# Altium schematic sheet SCH_ESPDMX V2.schdoc
size 487 x 214 mm
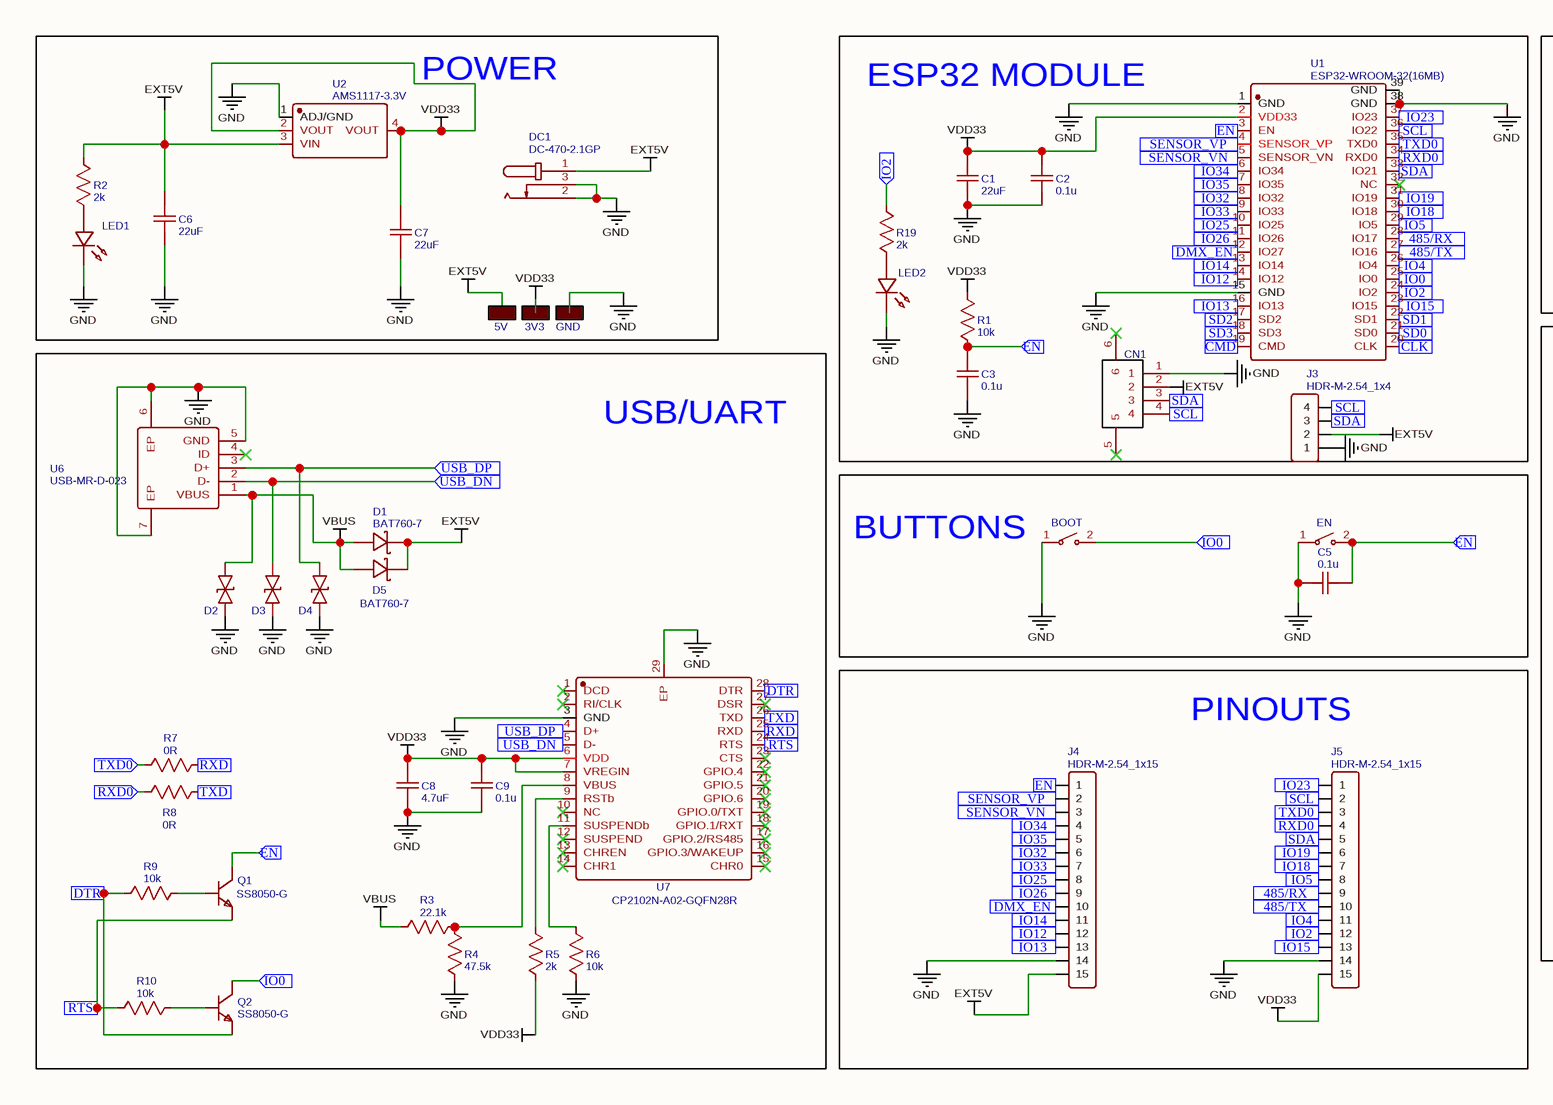
[diagram p0: SCH_ESPDMX V2.schdoc, left]
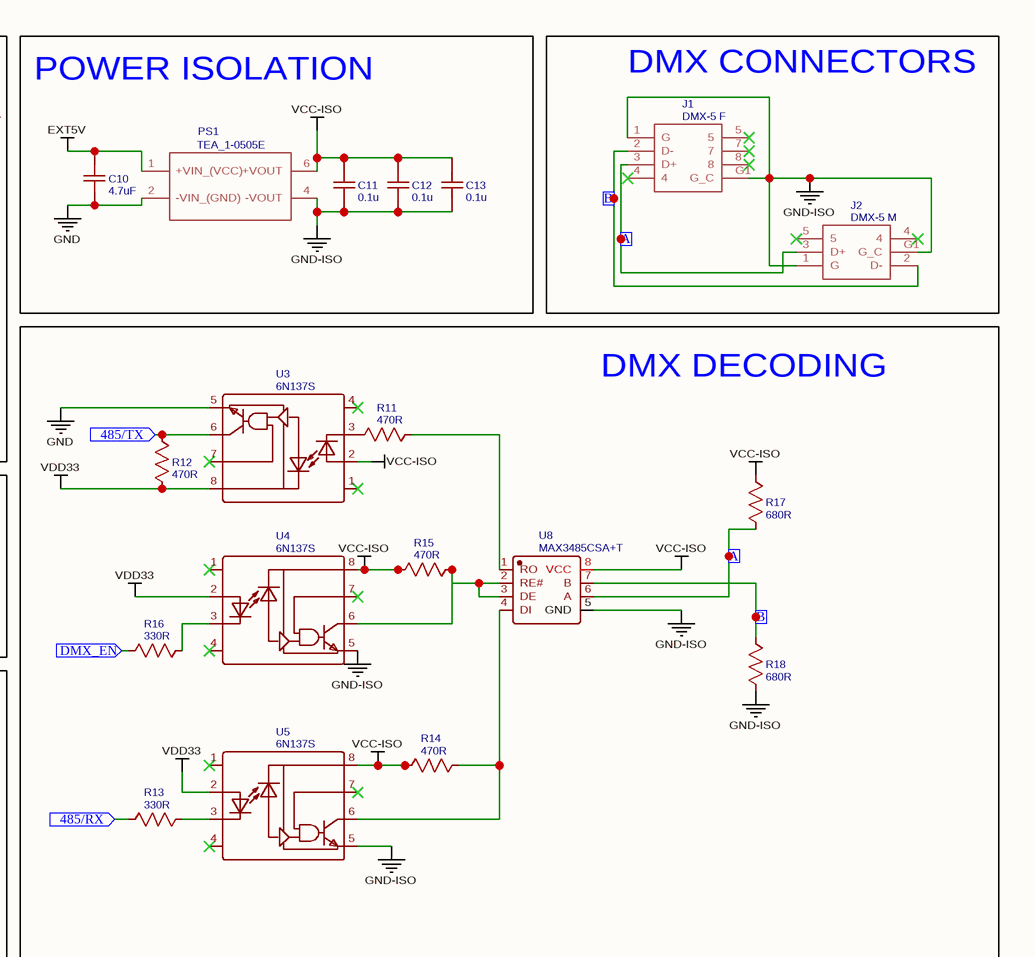
[diagram p1: SCH_ESPDMX V2.schdoc, right]

## Parts
3V3  SOLDERINGPADSONE  [SOLDERINGPAD_1]  (value not drawn)
5V  SOLDERINGPADSONE  [SOLDERINGPAD_1]  (value not drawn)
BOOT  TS-1088R-02026  [SW-SMD_L3.9-W3.0-P4.45]  (value not drawn)
C1  22uF  [C0805]
C2  0.1u  [C0805]
C3  0.1u  [C0805]
C5  0.1u  [C0805]
C6  22uF  [C0805]
C7  22uF  [C0805]
C8  4.7uF  [C0805]
C9  0.1u  [C0805]
C10  4.7uF  [C0805]
C11  0.1u  [C0805]
C12  0.1u  [C0805]
C13  0.1u  [C0805]
CN1  BM04B-GHS-TBT(LF)(SN)  [CONN-SMD_4P-P1.25_BM04B-GHS-TBT-LF-SN]  (value not drawn)
D1  BAT760-7  [SOD-323_L1.8-W1.3-LS2.5-RD]
D2  LESD5D5.0CT1G  [SOD-523_L1.2-W0.8-LS1.6-BI]  (value not drawn)
D3  LESD5D5.0CT1G  [SOD-523_L1.2-W0.8-LS1.6-BI]  (value not drawn)
D4  LESD5D5.0CT1G  [SOD-523_L1.2-W0.8-LS1.6-BI]  (value not drawn)
D5  BAT760-7  [SOD-323_L1.8-W1.3-LS2.5-RD]
DC1  DC-470-2.1GP  [DC-IN-TH_DC-470-2.1GP]
EN  TS-1088R-02026  [SW-SMD_L3.9-W3.0-P4.45]  (value not drawn)
GND  SOLDERINGPADSONE  [SOLDERINGPAD_1]  (value not drawn)
J1  DMX-5 F  [AC5FAHAUB]
J2  DMX-5 M  [AC5MAHAUB]
J3  HDR-M-2.54_1x4  [HDR-M-2.54_1X4]
J4  HDR-M-2.54_1x15  [HDR-M-2.54_1X15]
J5  HDR-M-2.54_1x15  [HDR-M-2.54_1X15]
LED1  LED-0805_R  [LED0805_RED]  (value not drawn)
LED2  LED-0805_B  [LED0805_BLUE]  (value not drawn)
PS1  TEA_1-0505E  [TEA10505E]
Q1  SS8050-G  [SOT-23-3_L2.9-W1.6-P1.90-LS2.8-BR]
Q2  SS8050-G  [SOT-23-3_L2.9-W1.6-P1.90-LS2.8-BR]
R1  10k  [R0805]
R2  2k  [R0805]
R3  22.1k  [R0805]
R4  47.5k  [R0805]
R5  2k  [R0805]
R6  10k  [R0805]
R7  0R  [R0805]
R8  0R  [R0805]
R9  10k  [R0805]
R10  10k  [R0805]
R11  470R  [R0805]
R12  470R  [R0805]
R13  330R  [R0805]
R14  470R  [R0805]
R15  470R  [R0805]
R16  330R  [R0805]
R17  680R  [R0805]
R18  680R  [R0805]
R19  2k  [R0805]
U1  ESP32-WROOM-32(16MB)  [WIFIM-SMD_39P-L25.5-W18.0-P1.27]
U2  AMS1117-3.3V  [SOT-223-4_L6.5-W3.5-P2.30-LS7.0-BR]
U3  6N137S  [SOP-8_L9.8-W6.6-P2.54-LS10.3-BL]
U4  6N137S  [SOP-8_L9.8-W6.6-P2.54-LS10.3-BL]
U5  6N137S  [SOP-8_L9.8-W6.6-P2.54-LS10.3-BL]
U6  USB-MR-D-023  [MICRO-USB-SMD_USB-MR-D-023]
U7  CP2102N-A02-GQFN28R  [QFN-28_L5.0-W5.0-P0.50-TL-EP3.3]
U8  MAX3485CSA+T  [SO-8_L4.9-W3.9-P1.27-LS6.0-BL]

## Blocks framed on the sheet
POWER: 3V3 5V C6 C7 DC1 GND LED1 R2 U2
ESP32 MODULE: C1-C3 CN1 J3 LED2 R1 R19 U1
POWER ISOLATION: C10-C13 PS1
DMX CONNECTORS: J1 J2
DMX DECODING: R11-R18 U3-U5 U8
USB/UART: C8 C9 D1-D5 Q1 Q2 R3-R10 U6 U7
BUTTONS: BOOT C5 EN
PINOUTS: J4 J5

## Ports
485/RX (in), 485/TX (in), A (in), B (in), CLK (in), CMD (in), DMX_EN (in), DTR (in), EN (in), IO0 (in), IO2 (in), IO4 (in), IO5 (in), IO12 (in), IO13 (in), IO14 (in), IO15 (in), IO18 (in), IO19 (in), IO23 (in), IO25 (in), IO26 (in), IO32 (in), IO33 (in), IO34 (in), IO35 (in), RTS (in), RXD0 (in), RXD (in), SCL (in), SD0 (in), SD1 (in), SD2 (in), SD3 (in), SDA (in), SENSOR_VN (in), SENSOR_VP (in), TXD0 (in), TXD (in), USB_DN (in), USB_DP (in)

## Nets
EXT5V: 5V.1 C6.2 C10.2 CN1.2 D1.1 D5.1 DC1.1 J3.2 J4.15 PS1.1(+VIN_(VCC)) R2.2 U2.3(VIN)
GND: BOOT.1 C1.1 C2.1 C3.1 C5.2 C6.1 C7.1 C8.1 C9.1 C10.1 CN1.1 D2.2 D3.2 D4.2 DC1.2 DC1.3 EN.1 GND.1 J3.1 J4.14 J5.14 LED1.2 LED2.2 PS1.2(-VIN_(GND)) R4.1 R6.1 U1.1(GND) U1.15(GND) U1.38(GND) U1.39(GND) U2.1(ADJ/GND) U3.5 U6.5(GND) U6.6(EP) U6.7(EP) U7.3(GND) U7.29(EP)
GND-ISO: C11.1 C12.1 C13.1 J1.1(G) J1.G1(G_C) J2.1(G) J2.G1(G_C) PS1.4(-VOUT) R18.2 U4.5 U5.5 U8.5(GND)
VBUS: D1.2 D2.1 D5.2 R3.1 U6.1(VBUS)
VCC-ISO: C11.2 C12.2 C13.2 PS1.6(+VOUT) R14.2 R15.2 R17.1 U3.2 U4.8 U5.8 U8.8(VCC)
VDD33: 3V3.1 C1.2 C2.2 C7.2 C8.2 C9.2 J5.15 R1.2 R5.1 R12.1 U1.2(VDD33) U2.2(VOUT) U2.4(VOUT) U3.8 U4.2 U5.2 U7.6(VDD) U7.7(VREGIN)
485/RX: J5.9 R13.2 U1.28(IO17) ; port 485/RX
485/TX: J5.10 R12.2 U1.27(IO16) U3.6 ; port 485/TX
A: J1.3(D+) J2.3(D+) R17.2 U8.6(A) ; port A
B: J1.2(D-) J2.2(D-) R18.1 U8.7(B) ; port B
CLK: U1.20(CLK) ; port CLK
CMD: U1.19(CMD) ; port CMD
DMX_EN: J4.10 R16.2 U1.12(IO27) ; port DMX_EN
DTR: Q2.2(E) R9.1 U7.28(DTR) ; port DTR
EN: C3.2 C5.1 EN.2 J4.1 Q1.3(C) R1.1 U1.3(EN) ; port EN
IO0: BOOT.2 Q2.3(C) U1.25(IO0) ; port IO0
IO2: J5.12 R19.2 U1.24(IO2) ; port IO2
IO4: J5.11 U1.26(IO4) ; port IO4
IO5: J5.8 U1.29(IO5) ; port IO5
IO12: J4.12 U1.14(IO12) ; port IO12
IO13: J4.13 U1.16(IO13) ; port IO13
IO14: J4.11 U1.13(IO14) ; port IO14
IO15: J5.13 U1.23(IO15) ; port IO15
IO18: J5.7 U1.30(IO18) ; port IO18
IO19: J5.6 U1.31(IO19) ; port IO19
IO23: J5.1 U1.37(IO23) ; port IO23
IO25: J4.8 U1.10(IO25) ; port IO25
IO26: J4.9 U1.11(IO26) ; port IO26
IO32: J4.6 U1.8(IO32) ; port IO32
IO33: J4.7 U1.9(IO33) ; port IO33
IO34: J4.4 U1.6(IO34) ; port IO34
IO35: J4.5 U1.7(IO35) ; port IO35
RTS: Q1.2(E) R10.1 U7.24(RTS) ; port RTS
RXD: R7.1 U7.25(RXD) ; port RXD
RXD0: J5.4 R8.2 U1.34(RXD0) ; port RXD0
SCL: CN1.4 J3.4 J5.2 U1.36(IO22) ; port SCL
SD0: U1.21(SD0) ; port SD0
SD1: U1.22(SD1) ; port SD1
SD2: U1.17(SD2) ; port SD2
SD3: U1.18(SD3) ; port SD3
SDA: CN1.3 J3.3 J5.5 U1.33(IO21) ; port SDA
SENSOR_VN: J4.3 U1.5(SENSOR_VN) ; port SENSOR_VN
SENSOR_VP: J4.2 U1.4(SENSOR_VP) ; port SENSOR_VP
TXD: R8.1 U7.26(TXD) ; port TXD
TXD0: J5.3 R7.2 U1.35(TXD0) ; port TXD0
USB_DN: D3.1 U6.2(D-) U7.5(D-) ; port USB_DN
USB_DP: D4.1 U6.3(D+) U7.4(D+) ; port USB_DP
NetLED1_1: LED1.1 R2.1
NetLED2_1: LED2.1 R19.1
NetQ1_1: Q1.1(B) R9.2
NetQ2_1: Q2.1(B) R10.2
NetR3_2: R3.2 R4.2 U7.8(VBUS)
NetR5_2: R5.2 U7.9(RSTb)
NetR6_2: R6.2 U7.11(SUSPENDb)
NetR11_1: R11.1 U3.3
NetR11_2: R11.2 U8.1(RO)
NetR13_1: R13.1 U5.3
NetR14_1: R14.1 U5.6 U8.4(DI)
NetR15_1: R15.1 U4.6 U8.2(RE#) U8.3(DE)
NetR16_1: R16.1 U4.3

Not connected (* = marked no-connect by the designer): CN1 5* 6*; J1 4* 5* 7* 8*; J2 4* 5*; U1 32(NC)*; U3 1* 4* 7*; U4 1* 4* 7*; U5 1* 4* 7*; U6 4(ID)*; U7 1(DCD)* 2(RI/CLK)* 10(NC)* 12(SUSPEND)* 13(CHREN)* 14(CHR1)* 15(CHR0)* 16(GPIO.3/WAKEUP)* 17(GPIO.2/RS485)* 18(GPIO.1/RXT)* 19(GPIO.0/TXT)* 20(GPIO.6)* 21(GPIO.5)* 22(GPIO.4)* 23(CTS)* 27(DSR)*

## Library data of the parts
3V3 5V GND = SOLDERINGPADSONE: Contributor: workowy.niezbedny; Supplier: RS-Online; spicePre: S; spiceSymbolName: SOLDERINGPADSONE
BOOT EN = TS-1088R-02026: Manufacturer: XUNPU(讯普); Contributor: LCSC; Package Display: No; Supplier: LCSC; Supplier Part: C455280; Manufacturer Part: TS-1088R-02026; JLCPCB Part Class: Extended Part; spicePre: S; spiceSymbolName: TS-1088R-02026
C1 C6 C7 = 22uF: nameAlias: Value(F); Contributor: LCEDA_Lib; Package Display: No; Info: 10V 20%; spicePre: C; spiceSymbolName: C_0805_US
C2 C3 C5 C9 C11-C13 = 0.1u: nameAlias: Value(F); Contributor: LCEDA_Lib; Info: 50V 10%; spicePre: C; spiceSymbolName: C_0805_US
C8 = 4.7uF: nameAlias: Value(F); Contributor: LCEDA_Lib; Info: 6.3V 10%; spicePre: C; spiceSymbolName: C_0805_US
C10 = 4.7uF: nameAlias: Value(F); Contributor: LCEDA_Lib; Package Display: No; Info: 10V 20%; spicePre: C; spiceSymbolName: C_0805_US
CN1 = BM04B-GHS-TBT(LF)(SN): Manufacturer: JST; Contributor: LCSC; Supplier: LCSC; Supplier Part: C161692; Manufacturer Part: BM04B-GHS-TBT(LF)(SN); JLCPCB Part Class: Extended Part; spicePre: C; spiceSymbolName: BM04B-GHS-TBT(LF)(SN)
D1 D5 = BAT760-7: Manufacturer: DIODES(美台); Contributor: LCSC; Supplier: LCSC; Manufacturer Part: BAT760-7; Supplier Part: C124187; JLCPCB Part Class: Extended Part; spicePre: D; spiceSymbolName: BAT760-7
D2-D4 = LESD5D5.0CT1G: Manufacturer: LRC(乐山无线电); Contributor: LCSC; Supplier: LCSC; Supplier Part: C383211; Manufacturer Part: LESD5D5.0CT1G; JLCPCB Part Class: Extended Part; spicePre: D; spiceSymbolName: LESD5D5.0CT1G
DC1 = DC-470-2.1GP: Manufacturer: GANGYUAN; Contributor: LCSC; Supplier: LCSC; Supplier Part: C194407; Manufacturer Part: DC-470-2.1GP; JLCPCB Part Class: Extended Part; spicePre: D; spiceSymbolName: DC-470-2.1GP
J1 = DMX-5 F: Contributor: Sol1; spicePre: J; spiceSymbolName: DMX-5 F
J2 = DMX-5 M: Contributor: Sol1; spicePre: J; spiceSymbolName: DMX-5 M
J3 = HDR-M-2.54_1x4: Contributor: LCEDA_Lib; Supplier Part: C124378; Supplier: LCSC; spicePre: J; spiceSymbolName: HDR-M-2.54_1x4
J4 J5 = HDR-M-2.54_1x15: Contributor: LCEDA_Lib; Supplier Part: C124373; Supplier: LCSC; spicePre: J; spiceSymbolName: HDR-M-2.54_1x15
LED1 = LED-0805_R: Manufacturer: EVERLIGHT(台湾亿光); Manufacturer Part: 17-21SURC/S530-A3/TR8; Contributor: LCEDA_Lib; Supplier Part: C72037; spicePre: L; spiceSymbolName: LED-0805_R
LED2 = LED-0805_B: Manufacturer: 方舟 ARKLED; Manufacturer Part: D-B080508B1-KS2; Contributor: LCEDA_Lib; Supplier Part: C108412; spicePre: L; spiceSymbolName: LED-0805_B
PS1 = TEA_1-0505E: Contributor: Sol1; spicePre: P; spiceSymbolName: TEA_1-0505E
Q1 Q2 = SS8050-G: Manufacturer: CJ(江苏长电/长晶); Contributor: LCSC; Supplier: LCSC; Manufacturer Part: SS8050-G; Supplier Part: C164886; JLCPCB Part Class: Extended Part; spicePre: Q; spiceSymbolName: SS8050-G
R1 R6 R9 R10 = 10k: nameAlias: Value(Ω); Contributor: LCEDA_Lib; Info: 5%; spicePre: R; spiceSymbolName: R_0805_US
R2 R19 = 2k: nameAlias: Value(Ω); Contributor: LCEDA_Lib; spicePre: R; spiceSymbolName: R_0805_US
R3 = 22.1k: nameAlias: Value(Ω); Contributor: LCEDA_Lib; Info: 5%; spicePre: R; spiceSymbolName: R_0805_US
R4 = 47.5k: nameAlias: Value(Ω); Contributor: LCEDA_Lib; Info: 5%; spicePre: R; spiceSymbolName: R_0805_US
R5 = 2k: nameAlias: Value(Ω); Contributor: LCEDA_Lib; Info: 5%; spicePre: R; spiceSymbolName: R_0805_US
R7 R8 = 0R: nameAlias: Value(Ω); Contributor: LCEDA_Lib; Info: 5%; spicePre: R; spiceSymbolName: R_0805_US
R11 R12 R14 R15 = 470R: nameAlias: Value(Ω); Contributor: LCEDA_Lib; spicePre: R; spiceSymbolName: R_0805_US
R13 R16 = 330R: nameAlias: Value(Ω); Contributor: LCEDA_Lib; spicePre: R; spiceSymbolName: R_0805_US
R17 R18 = 680R: nameAlias: Value(Ω); Contributor: LCEDA_Lib; spicePre: R; spiceSymbolName: R_0805_US
U1 = ESP32-WROOM-32(16MB): Manufacturer: ESPRESSIF(乐鑫); Manufacturer Part: ESP32-WROOM-32-N16; Contributor: LCSC; Supplier: LCSC; Supplier Part: C529581; JLCPCB Part Class: Extended Part; spicePre: U; spiceSymbolName: ESP32-WROOM-32(16MB)
U2 = AMS1117-3.3V: Manufacturer: WPMtek(维攀微); Contributor: LCSC; Supplier: LCSC; Supplier Part: C2688239; Manufacturer Part: AMS1117-3.3V; JLCPCB Part Class: Extended Part; spicePre: U; spiceSymbolName: AMS1117-3.3V
U3-U5 = 6N137S: Manufacturer: Slkor(萨科微); Contributor: LCSC; Supplier: LCSC; Supplier Part: C2918951; Manufacturer Part: 6N137S; JLCPCB Part Class: Extended Part; spicePre: U; spiceSymbolName: 6N137S
U6 = USB-MR-D-023: Manufacturer: DEALON(德艺隆); Contributor: lcsc; Supplier: LCSC; Supplier Part: C2926994; Manufacturer Part: USB-MR-D-023; link: https://atta.szlcsc.com/upload/public/pdf/source/20211217/B55D152C05BD08D900700AE46C37C70D.pdf; JLCPCB Part Class: Extended Part; spicePre: U; spiceSymbolName: USB-MR-D-023
U7 = CP2102N-A02-GQFN28R: Manufacturer: SILICON LABS(芯科); Contributor: LCSC; Supplier: LCSC; Supplier Part: C964632; Manufacturer Part: CP2102N-A02-GQFN28R; JLCPCB Part Class: Extended Part; spicePre: U; spiceSymbolName: CP2102N-A02-GQFN28R
U8 = MAX3485CSA+T: Manufacturer: MAXIM(美信); Contributor: LCSC; Supplier: LCSC; Supplier Part: C1121852; Manufacturer Part: MAX3485CSA+T; JLCPCB Part Class: Extended Part; spicePre: U; spiceSymbolName: MAX3485CSA+T